# Altium schematic sheet LAN8830_PINOUT.SchDoc
size C; SheetNumber: 18; SheetTotal: 21
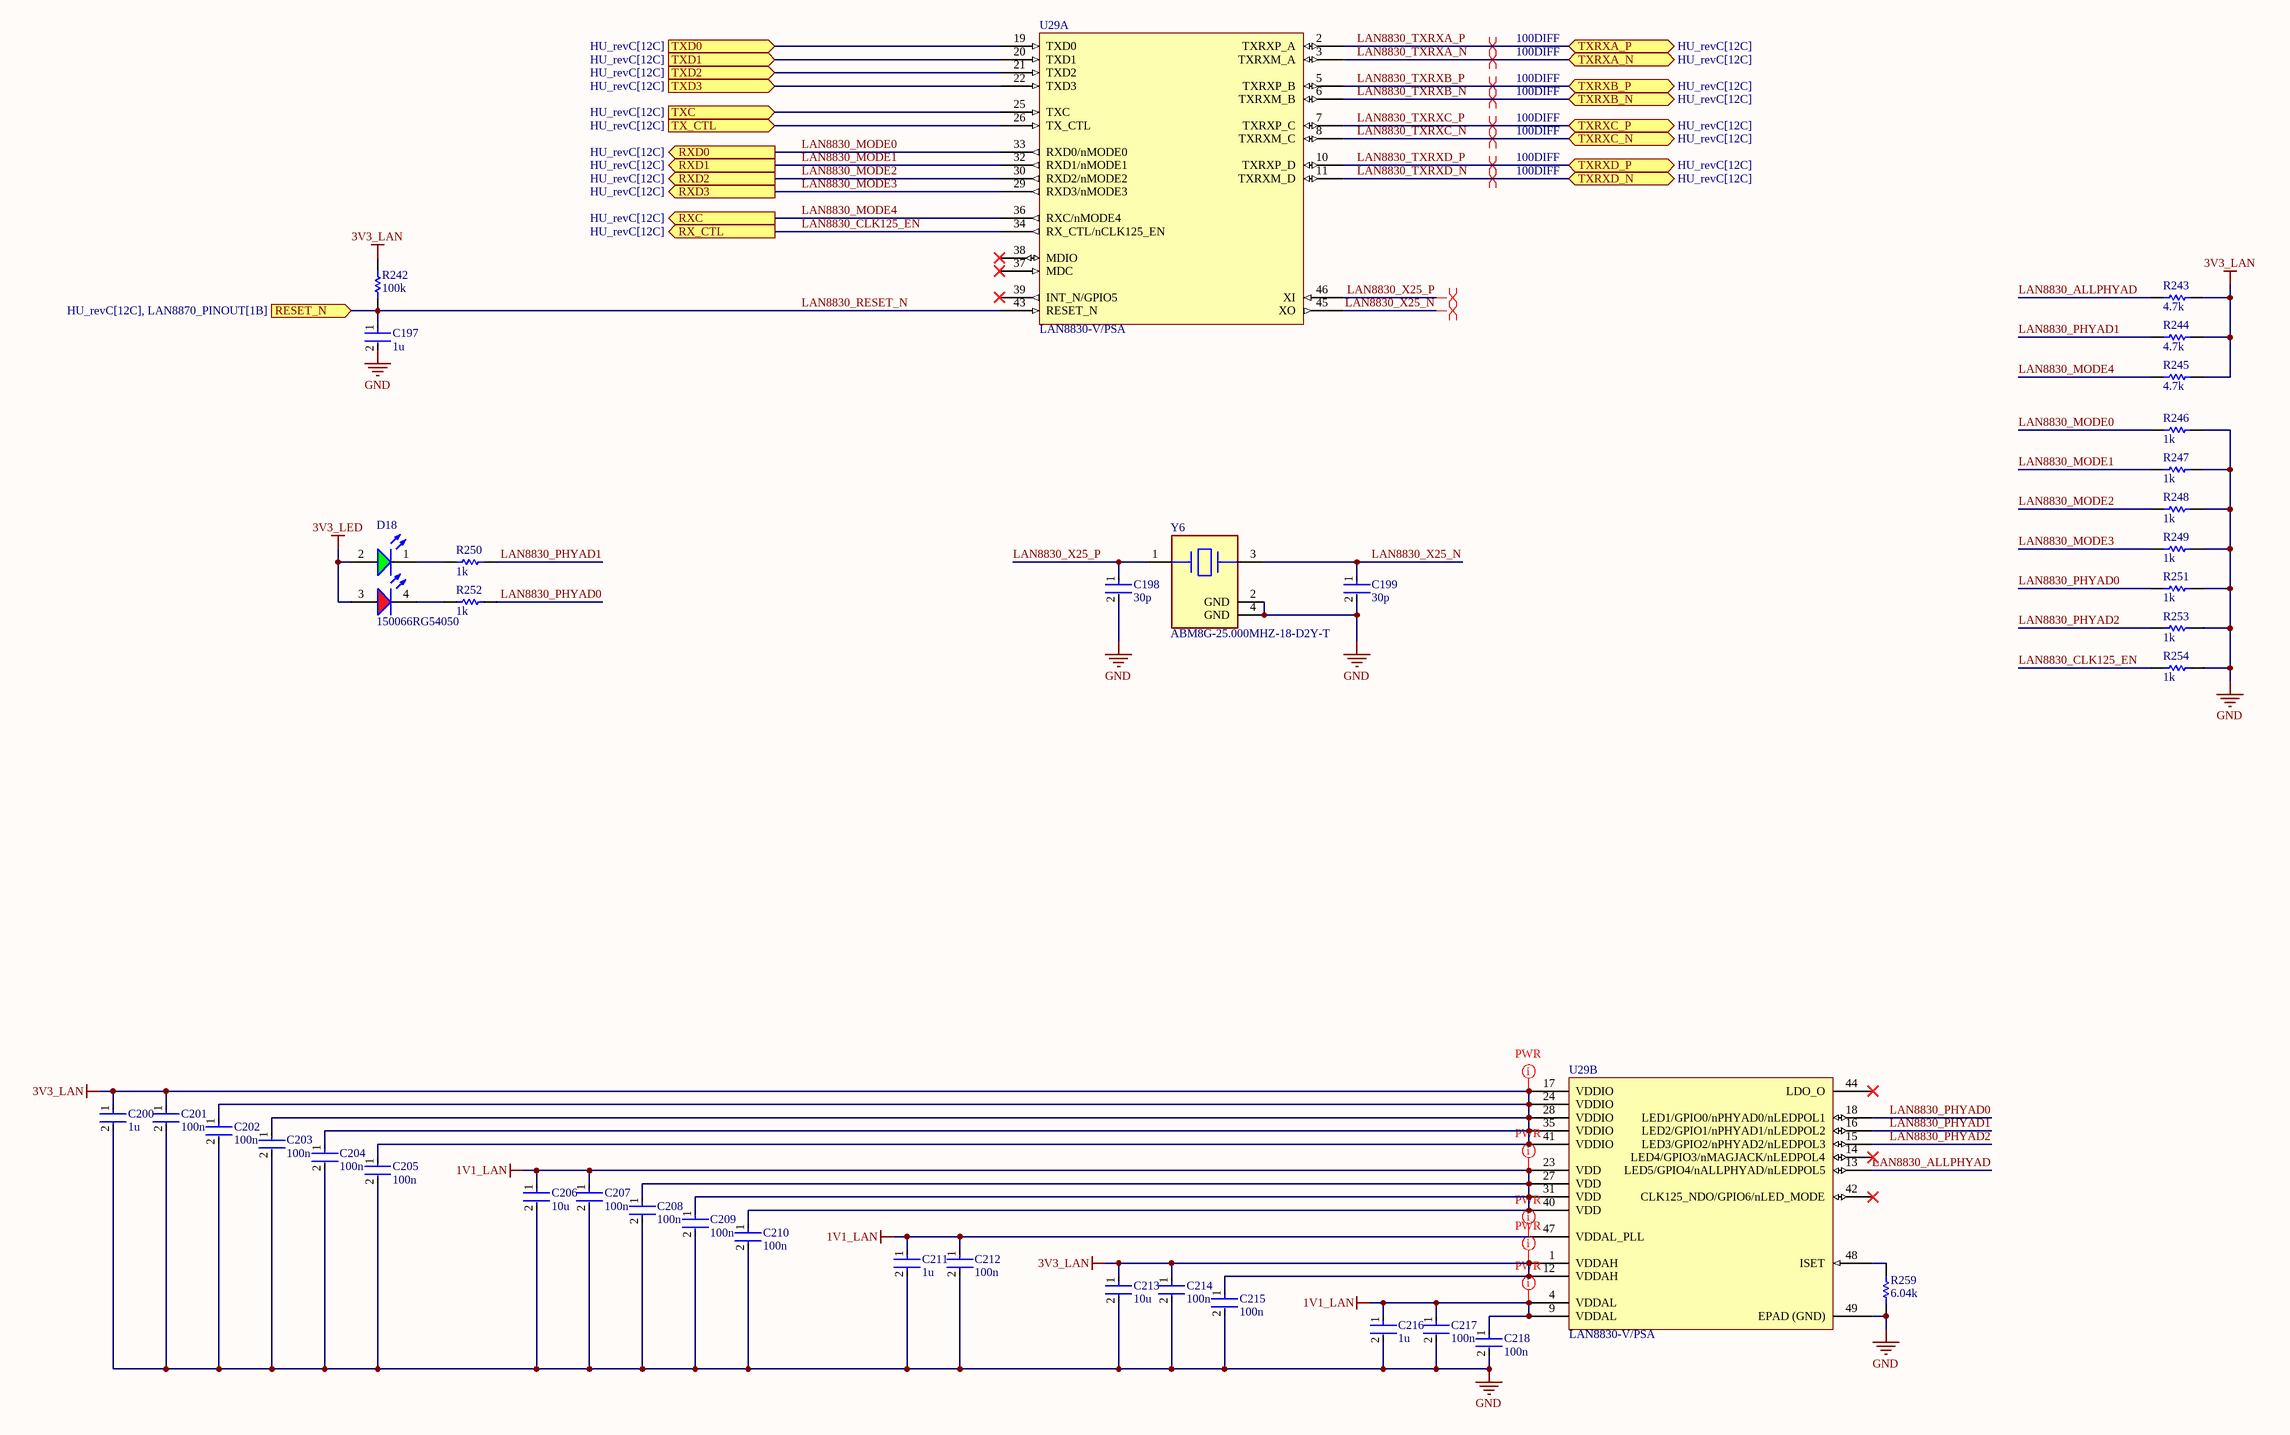
[diagram p0: LAN8830_PINOUT.SchDoc]

## Parts
C197  1u  [FP-0402-L_1_0_0_05-W_0_5-IPC_A]
C198  30p  [FP-0402-L_1_0_0_05-W_0_5-IPC_A]
C199  30p  [FP-0402-L_1_0_0_05-W_0_5-IPC_A]
C200  1u  [FP-0402-L_1_0_0_05-W_0_5-IPC_A]
C201  100n  [FP-0402-L_1_0_0_05-W_0_5-IPC_A]
C202  100n  [FP-0402-L_1_0_0_05-W_0_5-IPC_A]
C203  100n  [FP-0402-L_1_0_0_05-W_0_5-IPC_A]
C204  100n  [FP-0402-L_1_0_0_05-W_0_5-IPC_A]
C205  100n  [FP-0402-L_1_0_0_05-W_0_5-IPC_A]
C206  10u  [FP-0402-L_1_0_0_05-W_0_5-IPC_A]
C207  100n  [FP-0402-L_1_0_0_05-W_0_5-IPC_A]
C208  100n  [FP-0402-L_1_0_0_05-W_0_5-IPC_A]
C209  100n  [FP-0402-L_1_0_0_05-W_0_5-IPC_A]
C210  100n  [FP-0402-L_1_0_0_05-W_0_5-IPC_A]
C211  1u  [FP-0402-L_1_0_0_05-W_0_5-IPC_A]
C212  100n  [FP-0402-L_1_0_0_05-W_0_5-IPC_A]
C213  10u  [FP-0402-L_1_0_0_05-W_0_5-IPC_A]
C214  100n  [FP-0402-L_1_0_0_05-W_0_5-IPC_A]
C215  100n  [FP-0402-L_1_0_0_05-W_0_5-IPC_A]
C216  1u  [FP-0402-L_1_0_0_05-W_0_5-IPC_A]
C217  100n  [FP-0402-L_1_0_0_05-W_0_5-IPC_A]
C218  100n  [FP-0402-L_1_0_0_05-W_0_5-IPC_A]
D18  150066RG54050  [WL-SBCD_0606]
R242  100k  [R0603B]
R243  4.7k  [R0603B]
R244  4.7k  [R0603B]
R245  4.7k  [R0603B]
R246  1k  [R0603B]
R247  1k  [R0603B]
R248  1k  [R0603B]
R249  1k  [R0603B]
R250  1k  [R0603B]
R251  1k  [R0603B]
R252  1k  [R0603B]
R253  1k  [R0603B]
R254  1k  [R0603B]
R259  6.04k  [R0603B]
U29  LAN8830-V/PSA  [QFN50P700X700X100_HS-49N]  (parts A,B of 2)
Y6  ABM8G-25.000MHZ-18-D2Y-T  [FP-ABM8G-MFG]

## Ports
RESET_N (in, see HU_revC[12C], LAN8870_PINOUT[1B]), RX_CTL (out, see HU_revC[12C]), RXC (out, see HU_revC[12C]), RXD0 (out, see HU_revC[12C]), RXD1 (out, see HU_revC[12C]), RXD2 (out, see HU_revC[12C]), RXD3 (out, see HU_revC[12C]), TX_CTL (in, see HU_revC[12C]), TXC (in, see HU_revC[12C]), TXD0 (in, see HU_revC[12C]), TXD1 (in, see HU_revC[12C]), TXD2 (in, see HU_revC[12C]), TXD3 (in, see HU_revC[12C]), TXRXA_N (bidir, see HU_revC[12C]), TXRXA_P (bidir, see HU_revC[12C]), TXRXB_N (bidir, see HU_revC[12C]), TXRXB_P (bidir, see HU_revC[12C]), TXRXC_N (bidir, see HU_revC[12C]), TXRXC_P (bidir, see HU_revC[12C]), TXRXD_N (bidir, see HU_revC[12C]), TXRXD_P (bidir, see HU_revC[12C])

## Nets
1V1_LAN: C206.1 C207.1 C208.1 C209.1 C210.1 C211.1 C212.1 C216.1 C217.1 C218.1 U29.4(VDDAL) U29.9(VDDAL) U29.23(VDD) U29.27(VDD) U29.31(VDD) U29.40(VDD) U29.47(VDDAL_PLL)
3V3_LAN: C200.1 C201.1 C202.1 C203.1 C204.1 C205.1 C213.1 C214.1 C215.1 R242.1 R243.1 R244.1 R245.1 U29.1(VDDAH) U29.12(VDDAH) U29.17(VDDIO) U29.24(VDDIO) U29.28(VDDIO) U29.35(VDDIO) U29.41(VDDIO)
3V3_LED: D18.2(A) D18.3(A)
GND: C197.2 C198.2 C199.2 C200.2 C201.2 C202.2 C203.2 C204.2 C205.2 C206.2 C207.2 C208.2 C209.2 C210.2 C211.2 C212.2 C213.2 C214.2 C215.2 C216.2 C217.2 C218.2 R246.1 R247.1 R248.1 R249.1 R251.1 R253.1 R254.1 R259.2 U29.49(EPAD_(GND)) Y6.2(GND) Y6.4(GND)
LAN8830_ALLPHYAD: R243.2 U29.13(LED5/GPIO4/nALLPHYAD/nLEDPOL5)
LAN8830_CLK125_EN: R254.2 U29.34(RX_CTL/nCLK125_EN) ; port RX_CTL
LAN8830_MODE0: R246.2 U29.33(RXD0/nMODE0) ; port RXD0
LAN8830_MODE1: R247.2 U29.32(RXD1/nMODE1) ; port RXD1
LAN8830_MODE2: R248.2 U29.30(RXD2/nMODE2) ; port RXD2
LAN8830_MODE3: R249.2 U29.29(RXD3/nMODE3) ; port RXD3
LAN8830_MODE4: R245.2 U29.36(RXC/nMODE4) ; port RXC
LAN8830_PHYAD0: R251.2 R252.2 U29.18(LED1/GPIO0/nPHYAD0/nLEDPOL1)
LAN8830_PHYAD1: R244.2 R250.2 U29.16(LED2/GPIO1/nPHYAD1/nLEDPOL2)
LAN8830_PHYAD2: R253.2 U29.15(LED3/GPIO2/nPHYAD2/nLEDPOL3)
LAN8830_RESET_N: C197.1 R242.2 U29.43(RESET_N) ; port RESET_N
LAN8830_TXRXA_N: U29.3(TXRXM_A) ; port TXRXA_N
LAN8830_TXRXA_P: U29.2(TXRXP_A) ; port TXRXA_P
LAN8830_TXRXB_N: U29.6(TXRXM_B) ; port TXRXB_N
LAN8830_TXRXB_P: U29.5(TXRXP_B) ; port TXRXB_P
LAN8830_TXRXC_N: U29.8(TXRXM_C) ; port TXRXC_N
LAN8830_TXRXC_P: U29.7(TXRXP_C) ; port TXRXC_P
LAN8830_TXRXD_N: U29.11(TXRXM_D) ; port TXRXD_N
LAN8830_TXRXD_P: U29.10(TXRXP_D) ; port TXRXD_P
LAN8830_X25_N: C199.1 U29.45(XO) Y6.3
LAN8830_X25_P: C198.1 U29.46(XI) Y6.1
TX_CTL: U29.26(TX_CTL) ; port TX_CTL
TXC: U29.25(TXC) ; port TXC
TXD0: U29.19(TXD0) ; port TXD0
TXD1: U29.20(TXD1) ; port TXD1
TXD2: U29.21(TXD2) ; port TXD2
TXD3: U29.22(TXD3) ; port TXD3
NetD18_1: D18.1(K) R250.1
NetD18_4: D18.4(K) R252.1
NetR259_1: R259.1 U29.48(ISET)

Not connected (* = marked no-connect by the designer): U29 14(LED4/GPIO3/nMAGJACK/nLEDPOL4)* 37(MDC)* 38(MDIO)* 39(INT_N/GPIO5)* 42(CLK125_NDO/GPIO6/nLED_MODE)* 44(LDO_O)*

## Layout directives
differential pair; differential pair class 100DIFF: LAN8830_TXRXA_N, LAN8830_TXRXA_P, LAN8830_TXRXB_N, LAN8830_TXRXB_P, LAN8830_TXRXC_N, LAN8830_TXRXC_P, LAN8830_TXRXD_N, LAN8830_TXRXD_P
differential pair: LAN8830_X25_N, LAN8830_X25_P
net class PWR: 1V1_LAN, 3V3_LAN

## Library data of the parts
C197-C218 = CMP-001-00058-1: LARGE PADS, 0402 CAP, CHANGE COMMENT TO MATCH REAL P/N; Capacitor Type: Ceramic; Min Operating Temperature: -55°C; Mounting Technology: Surface Mount; Pins: 2; Case/Package: 0402; RoHS Compliant: Yes; Max Operating Temperature: 85°C
D18 = CMP-004-00040-2: Led, Red/Grn, 180Mcd/230Mcd, 624Nm/525Nm Rohs Compliant: Yes; Source: rgled.SchLib; Component Type: Standard; Design Item ID: CMP-004-00034-2; Pins: 4
R242-R254 R259 = CMP-009-00002-14: Resistor
  R242: Value: 100k
  R243-R245: Value: 4.7k
  R246-R254: Value: 1k
  R259: Value: 6.04k
U29 = CMP-015-00022-5: LAN8830 Series RGMII Interface Gigabit Ethernet Transceiver - VQFN-48; Case/Package: VQFN; Pins: 48
Y6 = CMP-2000-05733-3: Crystal 25MHz ±20ppm (Tol) ±30ppm (Stability) 18pF FUND 60Ω 4-Pin SMD T/R; Series Resistance: 60R; Length: 3.2mm; Depth: 2.5mm; Packaging: Tape and Reel; Min Operating Temperature: -40°C; Operating Frequency: 25 MHz; Lead Free: Lead Free; Number of Pins: 4; Frequency Tolerance: 20ppm; Radiation Hardening: No; Max Operating Temperature: 85°C; Termination: SMD/SMT; Frequency Stability: 30ppm; Frequency: 25MHz; Series: ABM8G; Mount: Surface Mount; Package Quantity: 1000; Height: 0.039inch; Width: 0.098inch; Case/Package: CSMD; ESR (Equivalent Series Resistance): 60R; Load Capacitance: 18pF; Tolerance: 20ppm